# Altium schematic sheet SPEXTRO_PowerBoard.SchDoc: SPEXTRO Power Board
size A4; Revision: 1A
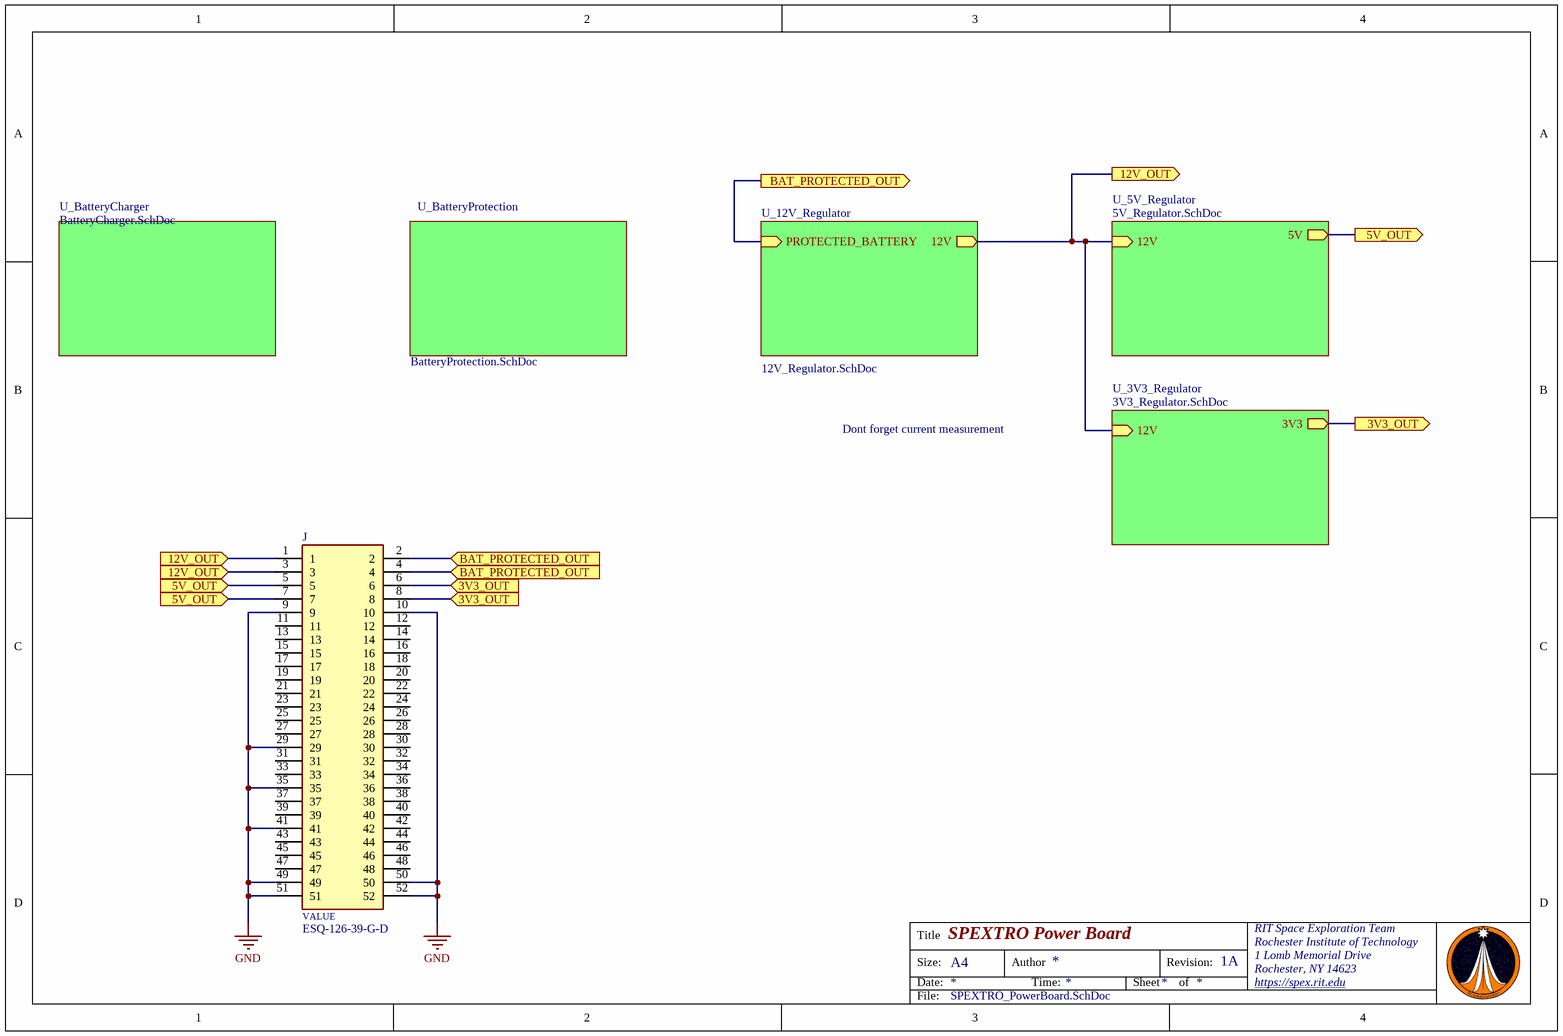
[diagram p0: SPEXTRO_PowerBoard.SchDoc]

## Parts
J  ESQ-126-39-G-D  [SAMTEC_ESQ-126-39-G-D]

## Sub-sheets
U_3V3_Regulator = 3V3_Regulator.SchDoc: 3V3 (out), 12V (in)
U_5V_Regulator = 5V_Regulator.SchDoc: 5V (out), 12V (in)
U_12V_Regulator = 12V_Regulator.SchDoc: PROTECTED_BATTERY (in), 12V (out)
U_BatteryCharger = BatteryCharger.SchDoc: no entries
U_BatteryProtection = BatteryProtection.SchDoc: no entries

## Ports
3V3_OUT (in), 3V3_OUT (out), 5V_OUT (in), 5V_OUT (out), 12V_OUT (in), 12V_OUT (out), BAT_PROTECTED_OUT (in), BAT_PROTECTED_OUT (out)

## Nets
GND: J.9 J.10 J.29 J.35 J.41 J.49 J.50 J.51 J.52
3V3_OUT: J.6 J.8 ; port 3V3_OUT, sheet U_3V3_Regulator/3V3
5V_OUT: J.5 J.7 ; port 5V_OUT, sheet U_5V_Regulator/5V
12V_OUT: J.1 J.3 ; port 12V_OUT, sheet U_12V_Regulator/12V, sheet U_5V_Regulator/12V, sheet U_3V3_Regulator/12V
BAT_PROTECTED_OUT: J.2 J.4 ; port BAT_PROTECTED_OUT, sheet U_12V_Regulator/PROTECTED_BATTERY

Not connected (* = marked no-connect by the designer): J 11 12 13 14 15 16 17 18 19 20 21 22 23 24 25 26 27 28 30 31 32 33 34 36 37 38 39 40 42 43 44 45 46 47 48

## Notes on the sheet
- Dont forget current measurement
- Title
- Size:
- Date:
- A4
- Author
- Time:
- Sheet
- Revision:
- of
- RIT Space Exploration Team
- Rochester Institute of Technology
- 1 Lomb Memorial Drive
- Rochester, NY 14623
- https://spex.rit.edu
- File:
- (in symbol ESQ-126-39-G-D) VALUE

## Library data of the parts
J = ESQ-126-39-G-D: 52 Position Elevated Socket Connector Through Hole; MF: Samtec; Value: *; Digi-Key_Purchase_URL: https://www.digikey.com/product-detail/en/samtec-inc/ESQ-126-39-G-D/SAM10462-ND/3601055?utm_source=snapeda&utm_medium=aggregator&utm_campaign=symbol; Package: None; MP: ESQ-126-39-G-D; SnapEDA_Link: https://www.snapeda.com/parts/ESQ-126-39-G-D/Samtec%20Inc./view-part/490181/?ref=snap; Digi-Key_Part_Number: SAM10462-ND